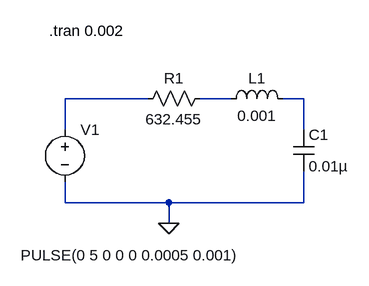
[diagram p0: schematic lab6.asc]
lab6.asc, the LTspice schematic file:
Version 4
SHEET 1 880 680
WIRE 144 80 16 80
WIRE 272 80 224 80
WIRE 384 80 352 80
WIRE 16 128 16 80
WIRE 384 128 384 80
WIRE 16 240 16 208
WIRE 176 240 16 240
WIRE 384 240 384 192
WIRE 384 240 176 240
WIRE 176 272 176 240
FLAG 176 272 0
SYMBOL voltage 16 112 R0
WINDOW 3 -68 209 Left 2
WINDOW 123 0 0 Left 0
WINDOW 39 0 0 Left 0
SYMATTR InstName V1
SYMATTR Value PULSE(0 5 0 0 0 0.0005 0.001)
SYMBOL res 240 64 R90
WINDOW 0 0 56 VBottom 2
WINDOW 3 32 56 VTop 2
SYMATTR InstName R1
SYMATTR Value 632.455
SYMBOL cap 368 128 R0
SYMATTR InstName C1
SYMATTR Value 0.01µ
SYMBOL ind 256 96 R270
WINDOW 0 32 56 VTop 2
WINDOW 3 5 56 VBottom 2
SYMATTR InstName L1
SYMATTR Value 0.001
TEXT -8 -24 Left 2 !.tran 0.002

The netlist it stands for:
* lab6.asc
V1 N001 0 PULSE(0 5 0 0 0 0.0005 0.001)
R1 N002 N001 632.455
C1 N003 0 0.01µ
L1 N002 N003 0.001
.tran 0.002
.backanno
.end